# Altium schematic sheet rlink.schdoc
size 209 x 297 mm; Scale: 1:1; DocumentType: Схема электрическая принципиальная; FirstReferrence: АБВГ.123456.001; PageSetup: Record=PageOptions|CenterHorizontal=False|CenterVertical=False|PrintScale=0.95|XCorrection=0.00|YCorrection=0.00|PrintKind=1|BorderSize=5000000|LeftOffset=0|BottomOffset=0|Orientation=1|PaperLength=1000|PaperWidth=1000|Scale=100|PaperSource=15|PrintQuality=600|MediaType=1|DitherType=10|PaperKind=A4|PrintScaleMode=1
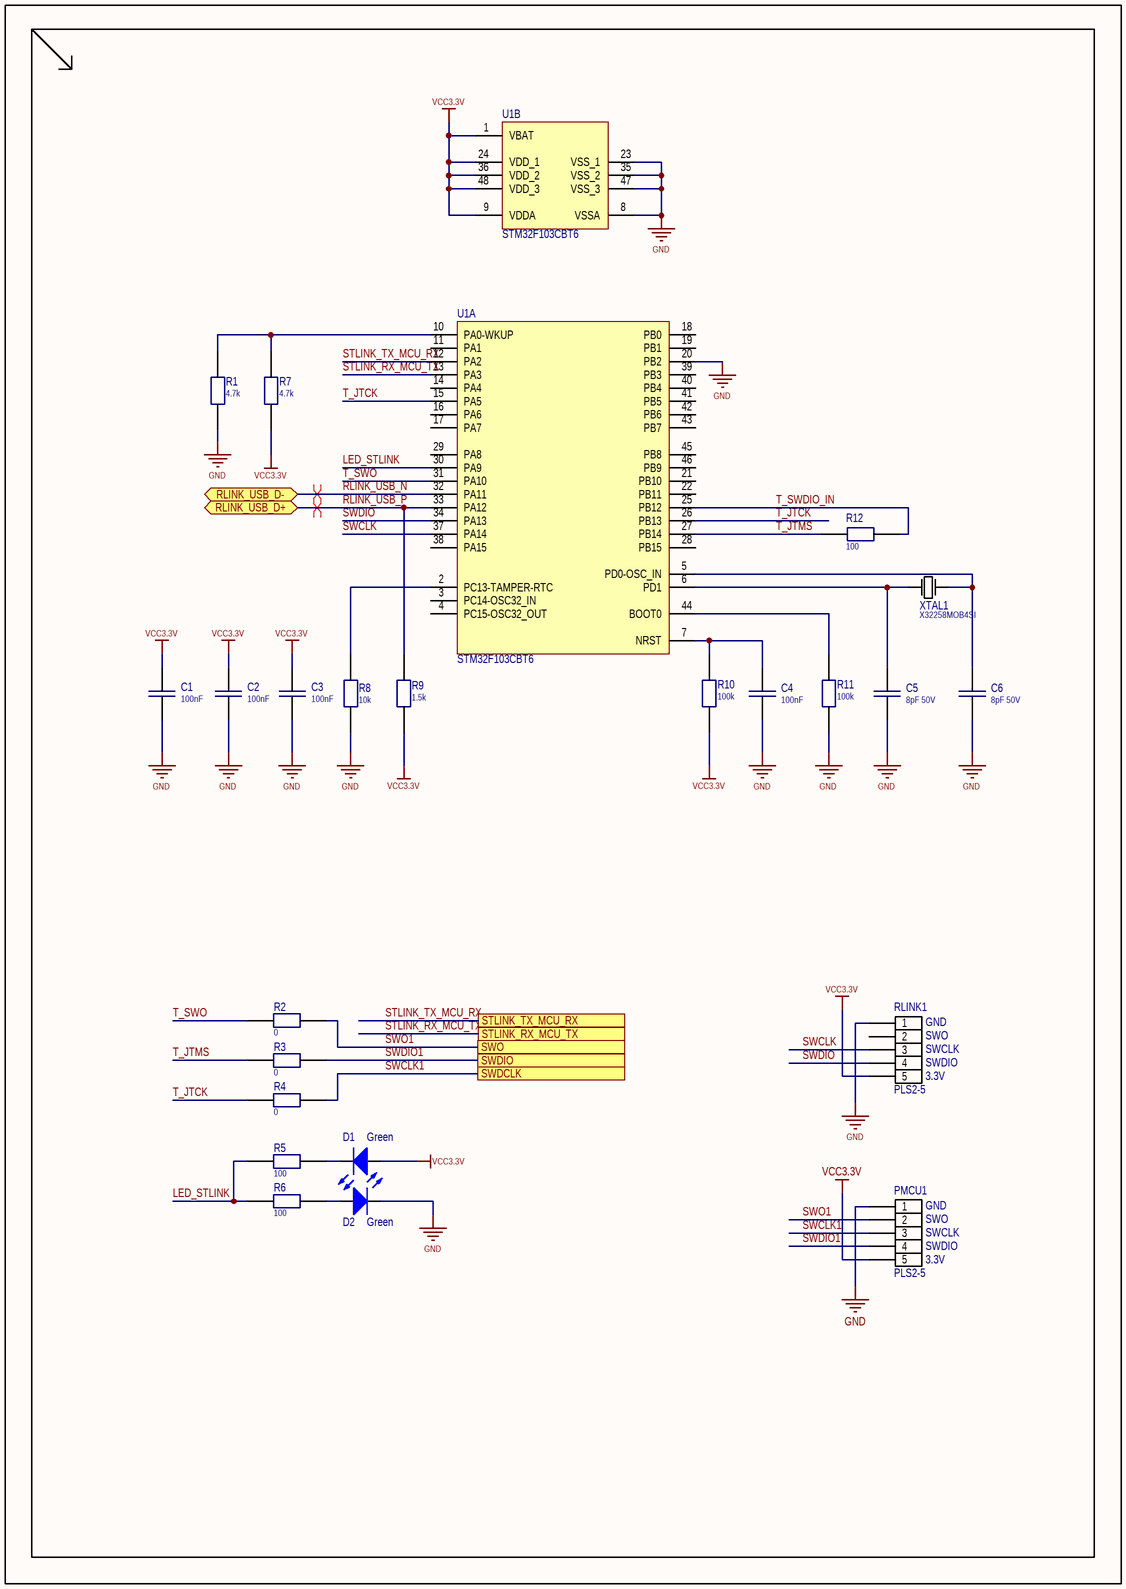
[diagram p0: rlink.schdoc]

## Parts
C1  100nF  [C_0603]
C2  100nF  [C_0603]
C3  100nF  [C_0603]
C4  100nF  [C_0603]
C5  8pF 50V  [C_0603]
C6  8pF 50V  [C_0603]
D1  Green  [LED_1206]
D2  Green  [LED_1206]
PMCU1  PLS2-5  [PLS-5-3D]  (no BOM)
R1  4.7k  [R_0603]
R2  0  [R_0603]
R3  0  [R_0603]
R4  0  [R_0603]
R5  100  [R_0603]
R6  100  [R_0603]
R7  4.7k  [R_0603]
R8  10k  [R_0603]
R9  1.5k  [R_0603]
R10  100k  [R_0603]
R11  100k  [R_0603]
R12  100  [R_0603]
RLINK1  PLS2-5  [PLS-5-3D]  (no BOM)
U1  STM32F103CBT6  [LQFP48_L]  (parts A,B of 2)
XTAL1  X32258MOB4SI  [NX3225GA]

## Ports
RLINK_USB_D+ (bidir), RLINK_USB_D- (bidir), STLINK_RX_MCU_TX, STLINK_TX_MCU_RX, SWDCLK, SWDIO, SWO

## Nets
GND: C1.1 C2.1 C3.1 C4.1 C5.1 C6.1 D2.2(K) PMCU1.1 R1.2 R8.2 R11.2 RLINK1.1 U1.8(VSSA) U1.20(PB2) U1.23(VSS_1) U1.35(VSS_2) U1.47(VSS_3)
VCC3.3V: C1.2 C2.2 C3.2 D1.1(A) PMCU1.5 R7.2 R9.2 R10.2 RLINK1.5 U1.1(VBAT) U1.9(VDDA) U1.24(VDD_1) U1.36(VDD_2) U1.48(VDD_3)
LED_STLINK: R5.2 R6.2 U1.30(PA9)
RLINK_USB_N: U1.32(PA11) ; port RLINK_USB_D-
RLINK_USB_P: R9.1 U1.33(PA12) ; port RLINK_USB_D+
STLINK_RX_MCU_TX: U1.13(PA3) ; port STLINK_RX_MCU_TX
STLINK_TX_MCU_RX: U1.12(PA2) ; port STLINK_TX_MCU_RX
SWCLK: RLINK1.3 U1.37(PA14)
SWCLK1: PMCU1.3 R4.1 ; port SWDCLK
SWDIO: RLINK1.4 U1.34(PA13)
SWDIO1: PMCU1.4 R3.1 ; port SWDIO
SWO1: PMCU1.2 R2.1 ; port SWO
T_JTCK: R4.2 U1.15(PA5) U1.26(PB13)
T_JTMS: R3.2 R12.2 U1.27(PB14)
T_SWDIO_IN: R12.1 U1.25(PB12)
T_SWO: R2.2 U1.31(PA10)
NetC4_2: C4.2 R10.1 U1.7(NRST)
NetC5_2: C5.2 U1.6(PD1) XTAL1.1(OSC1)
NetC6_2: C6.2 U1.5(PD0-OSC_IN) XTAL1.3(OSC2)
NetD1_2: D1.2(K) R5.1
NetD2_1: D2.1(A) R6.1
NetR1_1: R1.1 R7.1 U1.10(PA0-WKUP)
NetR8_1: R8.1 U1.2(PC13-TAMPER-RTC)
NetR11_1: R11.1 U1.44(BOOT0)

Not connected (* = marked no-connect by the designer): RLINK1 2; U1 3(PC14-OSC32_IN) 4(PC15-OSC32_OUT) 11(PA1) 14(PA4) 16(PA6) 17(PA7) 18(PB0) 19(PB1) 21(PB10) 22(PB11) 28(PB15) 29(PA8) 38(PA15) 39(PB3) 40(PB4) 41(PB5) 42(PB6) 43(PB7) 45(PB8) 46(PB9)

## Layout directives
differential pair: RLINK_USB_N, RLINK_USB_P

## Notes on the sheet
- (in symbol PLS2-5) GND; SWO; SWCLK; SWDIO; 3.3V

## Library data of the parts
C1-C4 = C0603: Capacitor; Part Number: CC0603JPX7R9BB104; Value: 100nF
C5 C6 = C0603: Capacitor; Part Number: CC0603DRNPO9BN8R0; Value: 8pF 50V
D1 D2 = LED_SMT_1206: Typical INFRARED GaAs LED; Part Number: KP-3216SGD; Value: *; Color: Green
PMCU1 RLINK1 = PLS2-5: Header, 5-Pin; Part Number: PLS-5; LatestRevisionDate: 17-Jul-2002; LatestRevisionNote: Re-released for DXP Platform.; Publisher: Altium Limited
R1 R7 = RES_SMD: Resistor; Part Number: RC0603FR-074K7L; Alternative Part: *; Value: 4.7k
R2-R4 = RES_SMD: Resistor; Part Number: RC0603FR-070RL; Alternative Part: *; Value: 0
R5 R6 R12 = RES_SMD: Resistor; Part Number: RC0603FR-07100RL; Alternative Part: *; Value: 100
R8 = RES_SMD: Resistor; Part Number: RC0603FR-0710KL; Alternative Part: *; Value: 10k
R9 = RES_SMD: Resistor; Part Number: RC0603FR-071K5L; Alternative Part: *; Value: 1.5k
R10 R11 = RES_SMD: Resistor; Part Number: RC0603FR-07100KL; Alternative Part: *; Value: 100k
U1 = STM32F103CBT6: STM32 ARM-based 32-bit MCU Performance Line with 128 kB Flash, 20 kB Internal RAM, -40 to +85°C Temperature, 48-Pin LQFP, Tray; DatasheetVersion: rev13.0, Apr-2011; PackageVersion: rev13, Apr-2011; PackageReference: LQFP48; PackageDescription: 48-Pin Low-Profile Quad Flat Pack, 7 x 7 mm Body, 0.5 mm Pitch (LQFP48); ComponentLink1Description: Manufacturer URL; ComponentLink1URL: http://www.st.com/; ComponentLink2Description: STM32F103 Datasheet; ComponentLink2URL: http://www.st.com/internet/com/TECHNICAL_RESOURCES/TECHNICAL_LITERATURE/DATASHEET/CD00161566.pdf; ComponentLink3Description: STM32 Family Web Page; ComponentLink3URL: www.st.com/stm32; Part Number: STM32F103CBT6
XTAL1 = NX3225GA: Crystal Oscillator; Part Number: X32258MOB4SI; Alternative Part: *